# EAGLE schematic field_mill (EAGLE 9.6.2)
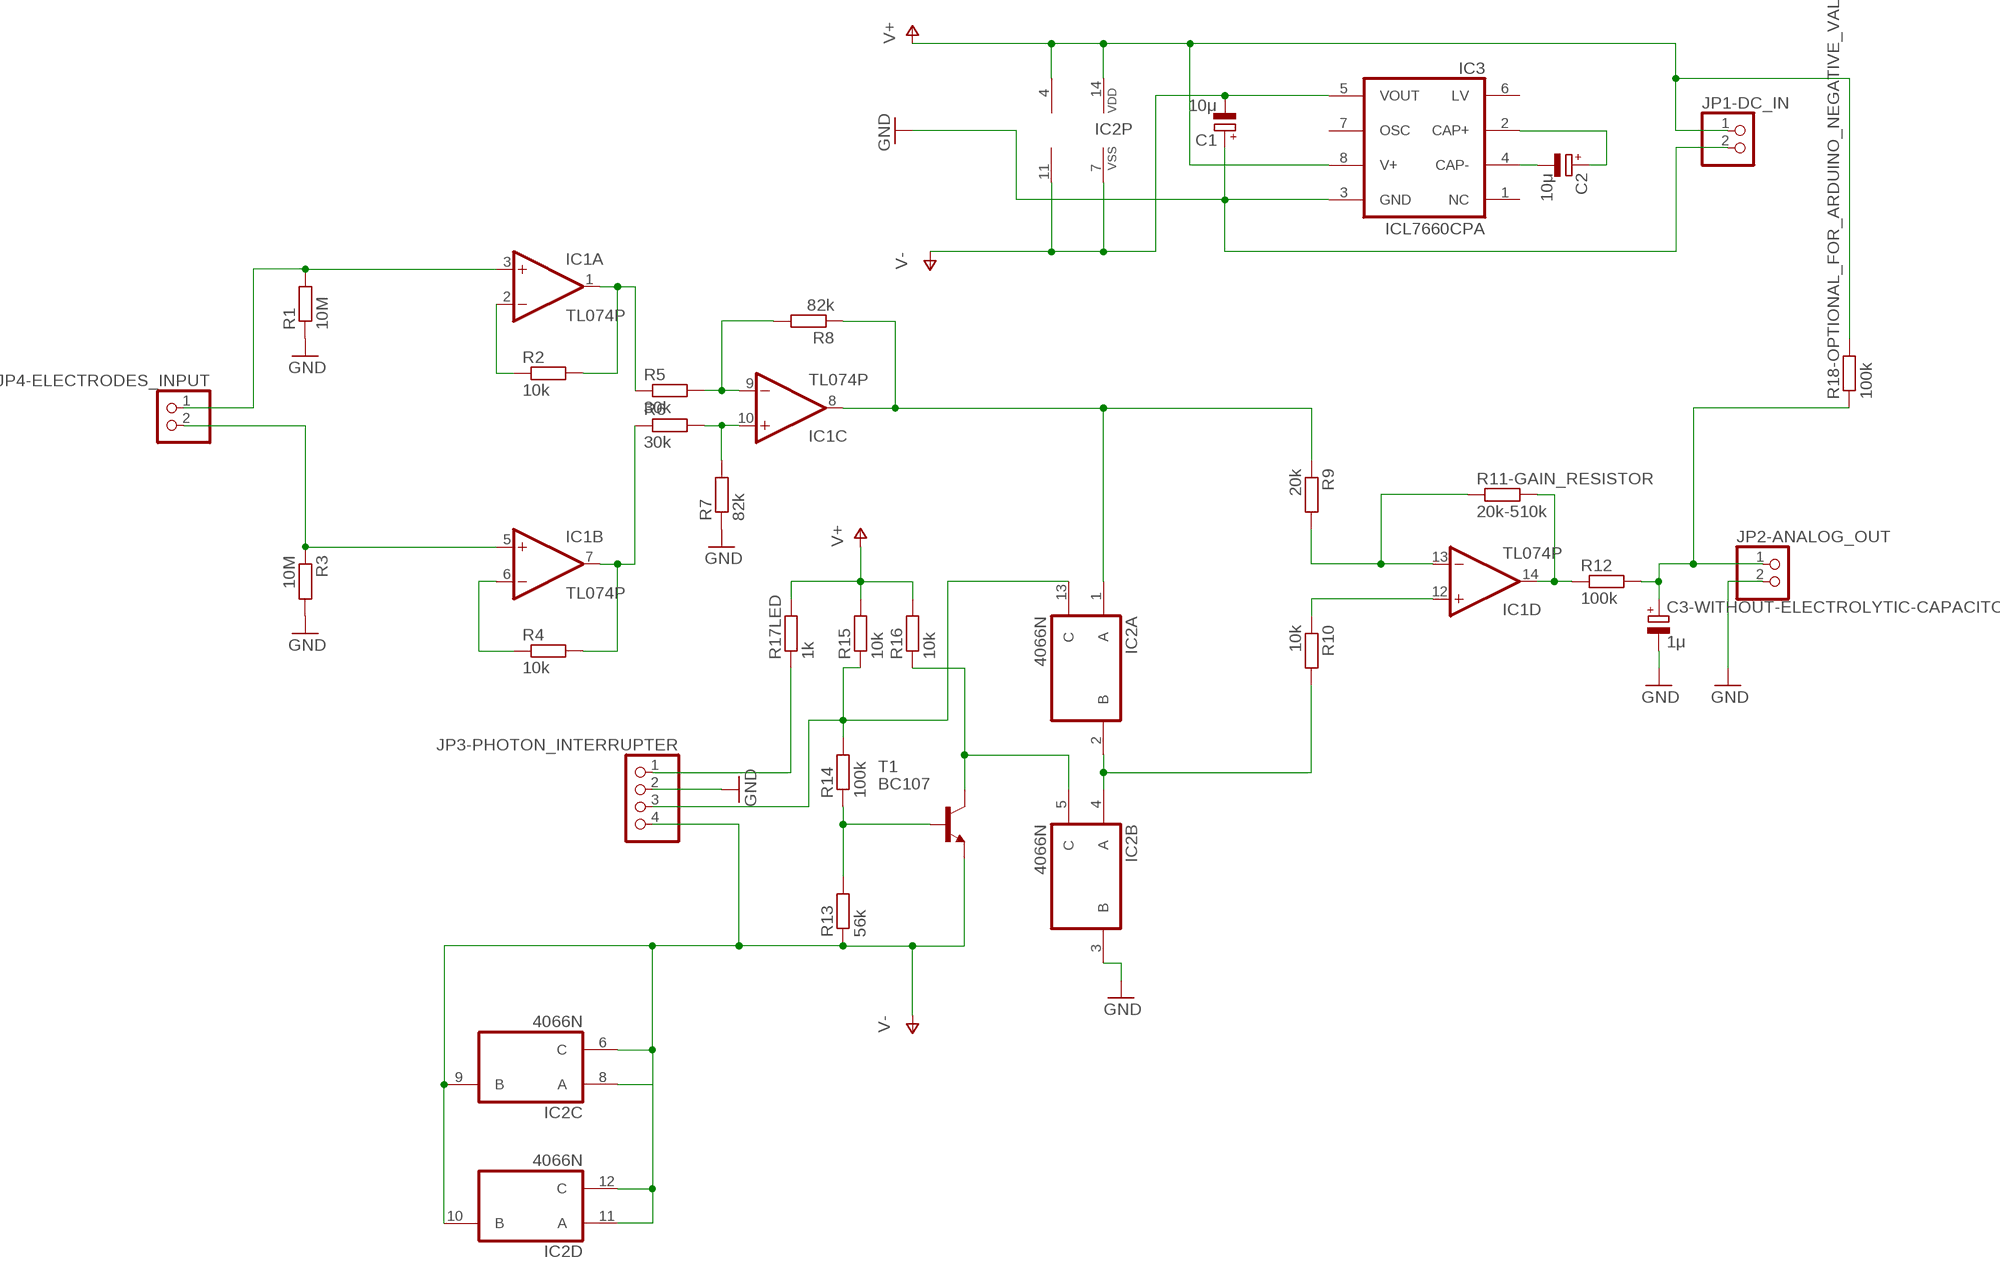
[diagram p0: schematic, sheet 1]

## Parts
C1  10μ  CPOL-EUE2.5-6  [E2,5-6]
C2  10μ  CPOL-EUE2.5-6  [E2,5-6]
C3-WITHOUT-ELECTROLYTIC-CAPACITOR  1μ  CPOL-EUE2.5-6  [E2,5-6]
IC1  TL074P  [DIL14]
IC2  4066N  [DIL14]
IC3  ICL7660CPA  [DIL08]
JP1-DC_IN  PINHD-1X2  [1X02]
JP2-ANALOG_OUT  PINHD-1X2  [1X02]
JP3-PHOTON_INTERRUPTER  PINHD-1X4  [1X04]
JP4-ELECTRODES_INPUT  PINHD-1X2  [1X02]
R1  10M  R-EU_0207/10  [0207/10]
R2  10k  R-EU_0207/10  [0207/10]
R3  10M  R-EU_0207/10  [0207/10]
R4  10k  R-EU_0207/10  [0207/10]
R5  30k  R-EU_0207/10  [0207/10]
R6  30k  R-EU_0207/10  [0207/10]
R7  82k  R-EU_0207/10  [0207/10]
R8  82k  R-EU_0207/10  [0207/10]
R9  20k  R-EU_0207/10  [0207/10]
R10  10k  R-EU_0207/10  [0207/10]
R11-GAIN_RESISTOR  20k-510k  R-EU_0207/10  [0207/10]
R12  100k  R-EU_0207/10  [0207/10]
R13  56k  R-EU_0207/10  [0207/10]
R14  100k  R-EU_0207/10  [0207/10]
R15  10k  R-EU_0207/10  [0207/10]
R16  10k  R-EU_0207/10  [0207/10]
R17LED  1k  R-EU_0207/10  [0207/10]
R18-OPTIONAL_FOR_ARDUINO_NEGATIVE_VALUES  100k  R-EU_0207/10  [0207/10]
T1  BC107  [TO18]

## Nets
GND: C1.+ C3-WITHOUT-ELECTROLYTIC-CAPACITOR.- IC2.3(B:B) IC3.3(GND) JP1-DC_IN.2 JP2-ANALOG_OUT.2 JP3-PHOTON_INTERRUPTER.2 R1.1 R3.2 R7.1
N$1: C2.- IC3.4(CAP-)
N$2: C2.+ IC3.2(CAP+)
N$3: IC1.9(C:-IN) R5.2 R8.2
N$4: IC1.10(C:+IN) R6.2 R7.2
N$5: IC1.1(A:OUT) R2.2 R5.1
N$6: IC1.8(C:OUT) IC2.1(A:A) R8.1 R9.1
N$7: IC1.2(A:-IN) R2.1
N$8: IC1.3(A:+IN) JP4-ELECTRODES_INPUT.1 R1.2
N$9: IC1.6(B:-IN) R4.1
N$10: IC1.7(B:OUT) R4.2 R6.1
N$11: IC1.5(B:+IN) JP4-ELECTRODES_INPUT.2 R3.1
N$12: IC2.2(A:B) IC2.4(B:A) R10.2
N$13: IC1.12(D:+IN) R10.1
N$14: IC1.13(D:-IN) R9.2 R11-GAIN_RESISTOR.1
N$15: IC1.14(D:OUT) R11-GAIN_RESISTOR.2 R12.1
N$16: C3-WITHOUT-ELECTROLYTIC-CAPACITOR.+ JP2-ANALOG_OUT.1 R12.2 R18-OPTIONAL_FOR_ARDUINO_NEGATIVE_VALUES.1
N$17: JP3-PHOTON_INTERRUPTER.1 R17LED.1
N$18: IC2.13(A:C) JP3-PHOTON_INTERRUPTER.3 R14.2 R15.1
N$19: R13.2 R14.1 T1.2(B)
N$20: IC2.5(B:C) R16.1 T1.3(C)
V+: IC1.4(P:V+) IC2.14(P:VDD) IC3.8(V+) JP1-DC_IN.1 R15.2 R16.2 R17LED.2 R18-OPTIONAL_FOR_ARDUINO_NEGATIVE_VALUES.2
V-: C1.- IC1.11(P:V-) IC2.6(C:C) IC2.7(P:VSS) IC2.8(C:A) IC2.9(C:B) IC2.10(D:B) IC2.11(D:A) IC2.12(D:C) IC3.5(VOUT) JP3-PHOTON_INTERRUPTER.4 R13.1 T1.1(E)
Unconnected: IC3.1(NC) IC3.6(LV) IC3.7(OSC)

## Library data of the parts
C1 C2 C3-WITHOUT-ELECTROLYTIC-CAPACITOR = resistor:CPOL-EU: POLARIZED CAPACITOR, European symbol
IC1 = linear:TL074: OP AMP
IC2 = 40xx:4066: Quad bilateral ANALOG SWITCH
IC3 = maxim:ICL7660CPA: VOLTAGE CONVERTER; MF: INTERSIL; MPN: ICL7660CPA; OC_FARNELL: 1018170; OC_NEWARK: 06F7441
JP1-DC_IN JP2-ANALOG_OUT JP4-ELECTRODES_INPUT = pinhead:PINHD-1X2: PIN HEADER
JP3-PHOTON_INTERRUPTER = pinhead:PINHD-1X4: PIN HEADER
R1-R10 R11-GAIN_RESISTOR R12-R16 R17LED R18-OPTIONAL_FOR_ARDUINO_NEGATIVE_VALUES = resistor:R-EU_: RESISTOR, European symbol
T1 = transistor:BC107: NPN TRANSISTOR